# EAGLE design arduinoRGBkaleidoscopeCkt1_v4 (EAGLE 9.2.2)
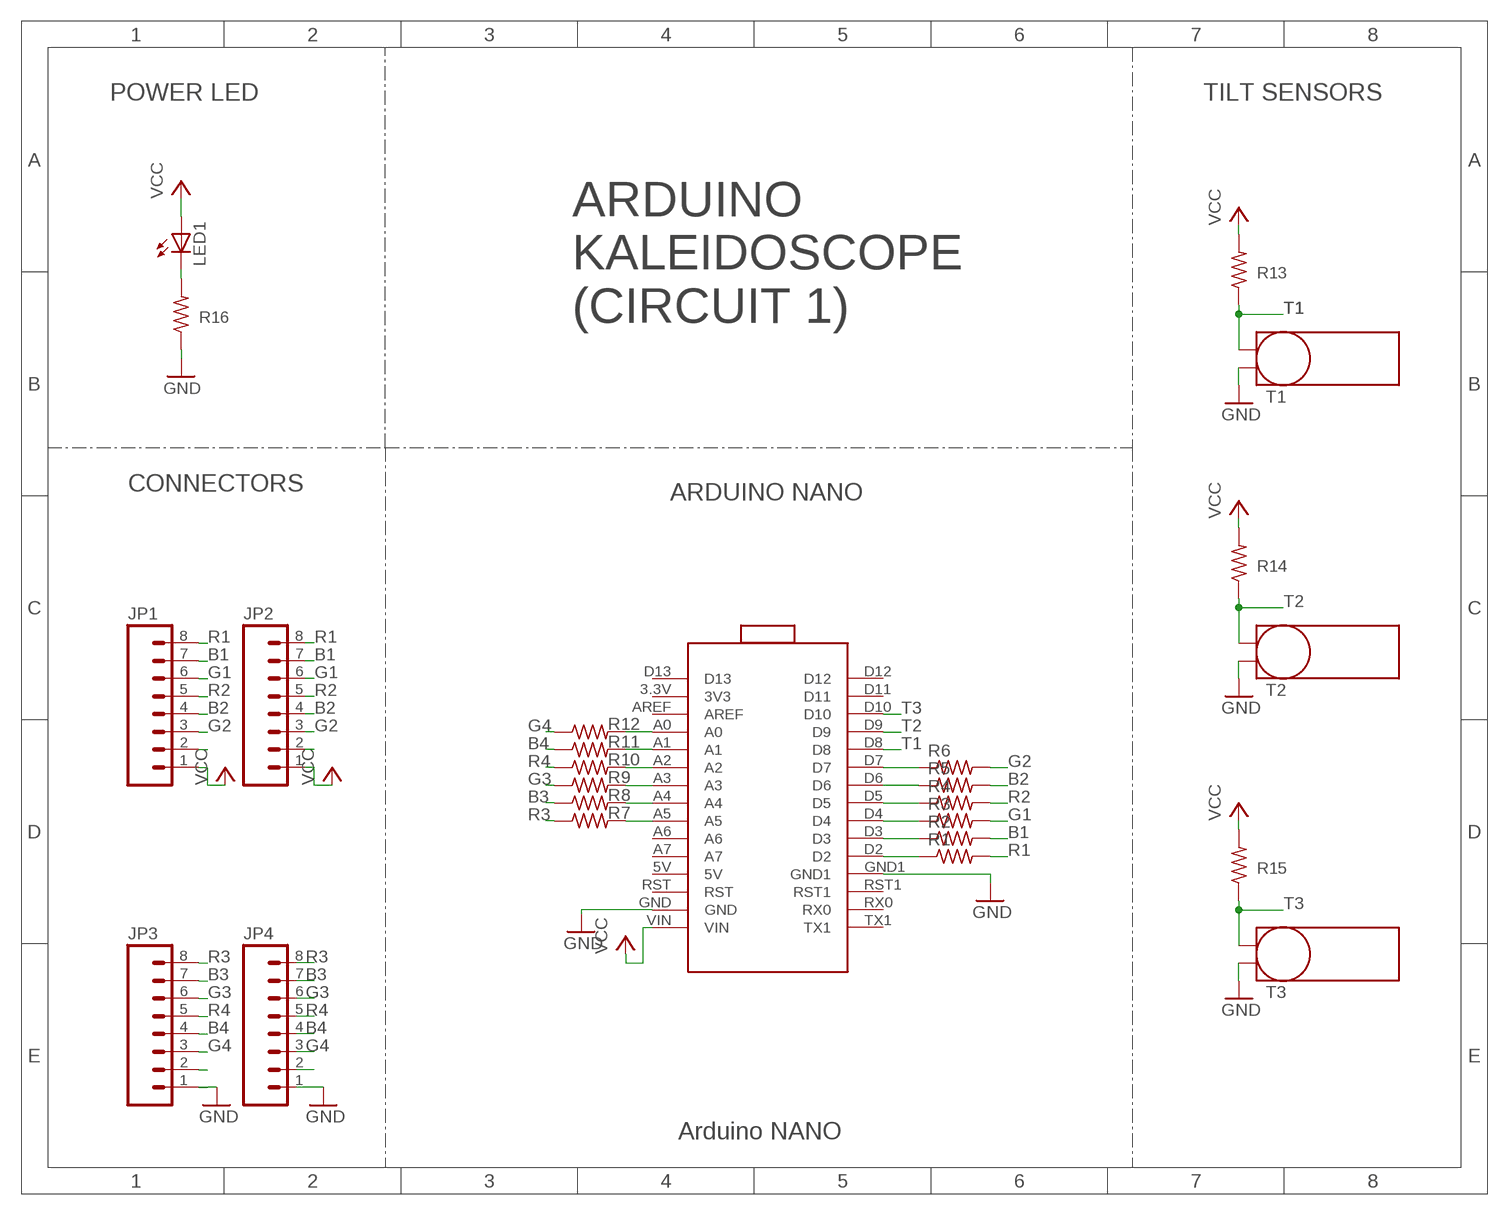
[diagram p0: schematic, sheet 1]

## Parts
JP1  M081X08  [1X08]
JP2  M081X08  [1X08]
JP3  M081X08  [1X08]
JP4  M081X08  [1X08]
LED1  LED3MM  [LED3MM]
R1  RESISTOR0805  [R0805]
R2  RESISTOR0805  [R0805]
R3  RESISTOR0805  [R0805]
R4  RESISTOR0805  [R0805]
R5  RESISTOR0805  [R0805]
R6  RESISTOR0805  [R0805]
R7  RESISTOR0805  [R0805]
R8  RESISTOR0805  [R0805]
R9  RESISTOR0805  [R0805]
R10  RESISTOR0805  [R0805]
R11  RESISTOR0805  [R0805]
R12  RESISTOR0805  [R0805]
R13  R-US_0204/7  [0204/7]
R14  R-US_0204/7  [0204/7]
R15  R-US_0204/7  [0204/7]
R16  R-US_0204/7  [0204/7]
T1  TILTSENSORE2.5-7  [TILTSENSOR]
T2  TILTSENSORE2.5-7  [TILTSENSOR]
T3  TILTSENSORE2.5-7  [TILTSENSOR]
U$2  NANO  [NANO-2]

## Nets
B1: JP1.7 JP2.7 R2.2
B2: JP1.4 JP2.4 R5.2
B3: JP3.7 JP4.7 R8.1
B4: JP3.4 JP4.4 R11.1
G1: JP1.6 JP2.6 R3.2
G2: JP1.3 JP2.3 R6.2
G3: JP3.6 JP4.6 R9.1
G4: JP3.3 JP4.3 R12.1
GND: JP3.1 JP4.1 R16.1 T1.- T2.- T3.- U$2.GND U$2.GND1
N$1: R12.2 U$2.A0
N$2: R11.2 U$2.A1
N$3: R10.2 U$2.A2
N$4: R9.2 U$2.A3
N$5: R8.2 U$2.A4
N$6: R7.2 U$2.A5
N$7: R6.1 U$2.D7
N$8: R5.1 U$2.D6
N$9: R4.1 U$2.D5
N$10: R3.1 U$2.D4
N$11: R2.1 U$2.D3
N$12: R1.1 U$2.D2
N$14: LED1.K(C) R16.2
N$15: JP2.2
N$28: JP1.2
N$36: JP4.2
N$44: JP3.2
R1: JP1.8 JP2.8 R1.2
R2: JP1.5 JP2.5 R4.2
R3: JP3.8 JP4.8 R7.1
R4: JP3.5 JP4.5 R10.1
T1: R13.1 T1.+ U$2.D8
T2: R14.1 T2.+ U$2.D9
T3: R15.1 T3.+ U$2.D10
VCC: JP1.1 JP2.1 LED1.A R13.2 R14.2 R15.2 U$2.VIN
Unconnected: U$2.3.3V(3V3) U$2.5V U$2.A6 U$2.A7 U$2.AREF U$2.D11 U$2.D12 U$2.D13 U$2.RST U$2.RST1 U$2.RX0 U$2.TX1

## Notes on the sheet
- POWER LED | TILT SENSORS
- ARDUINO
  KALEIDOSCOPE
  (CIRCUIT 1)
- CONNECTORS
- ARDUINO NANO
- Arduino NANO

## Library data of the parts
JP1-JP4 = SparkFun-Connectors:M08: Header 8 Standard 8-pin 0.1" header. Use with straight break away headers (SKU : PRT-00116), right angle break away headers (PRT-00553), swiss pins (PRT-00743), machine pins (PRT-00117), and female headers (PRT-00115).
LED1 = CEDT_JANUARY_2015_v6 (2):LED
R1-R12 = CEDT_JANUARY_2015:RESISTOR
R13-R16 = rcl:R-US_: RESISTOR, American symbol; SPICEPREFIX: R
T1-T3 = tilt-sensor:TILTSENSOR: TILT SENSOR, American symbol
U$2 = Arduino-clone:NANO: Arduino Nano

## Net classes
1 VCC: width 0.61 mm
2 GND: width 0.61 mm

## Board
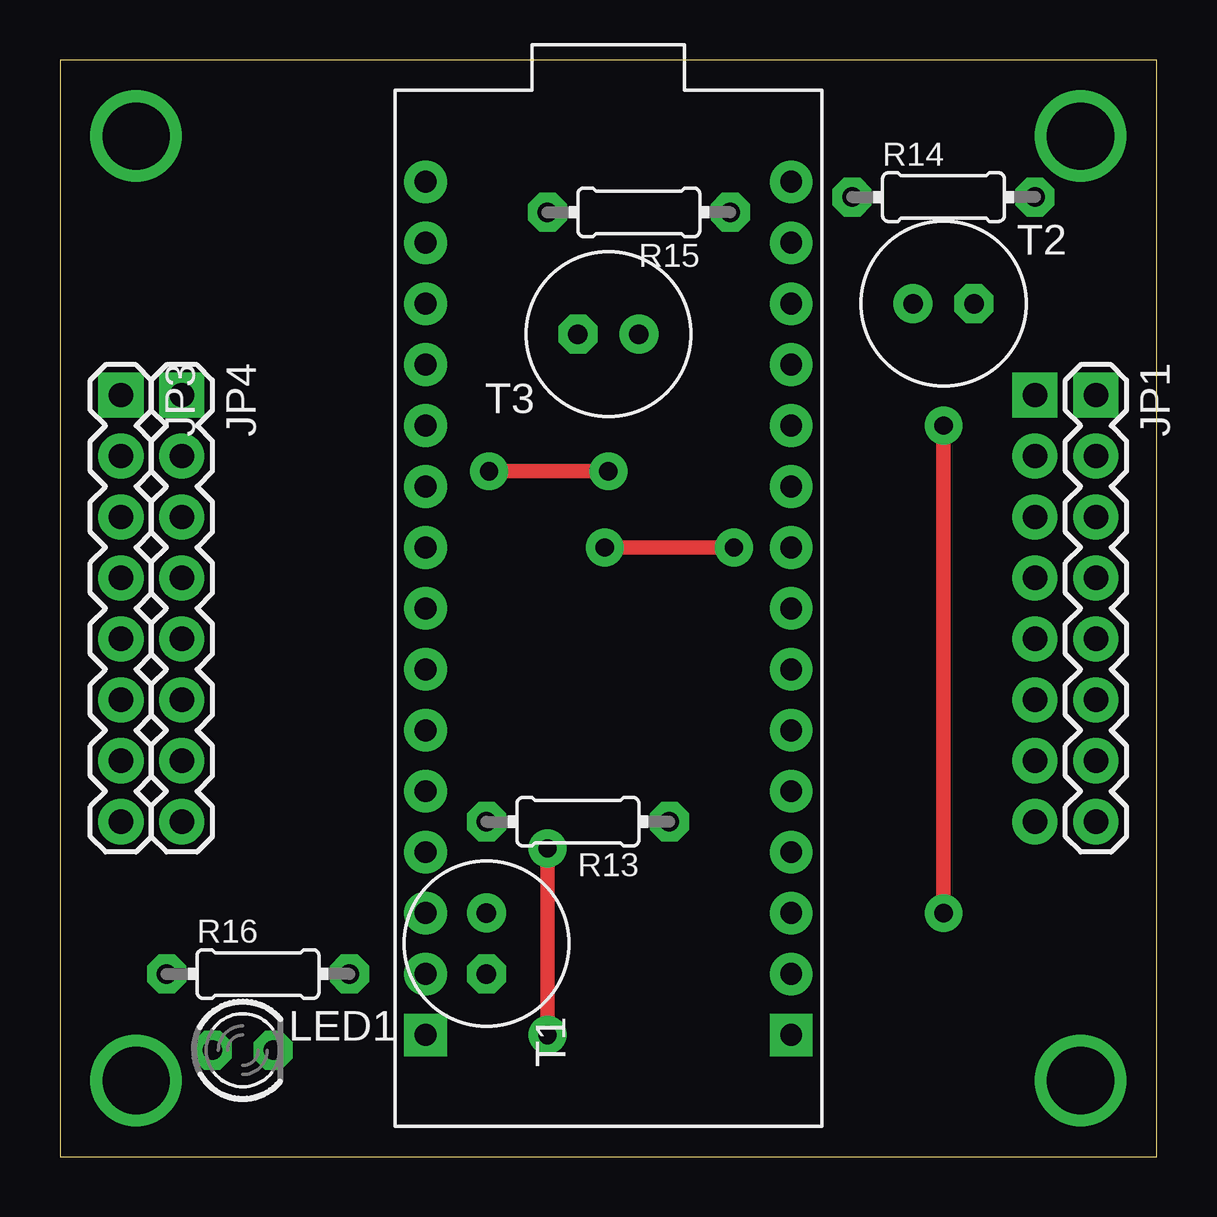
[diagram p1: board, top side]
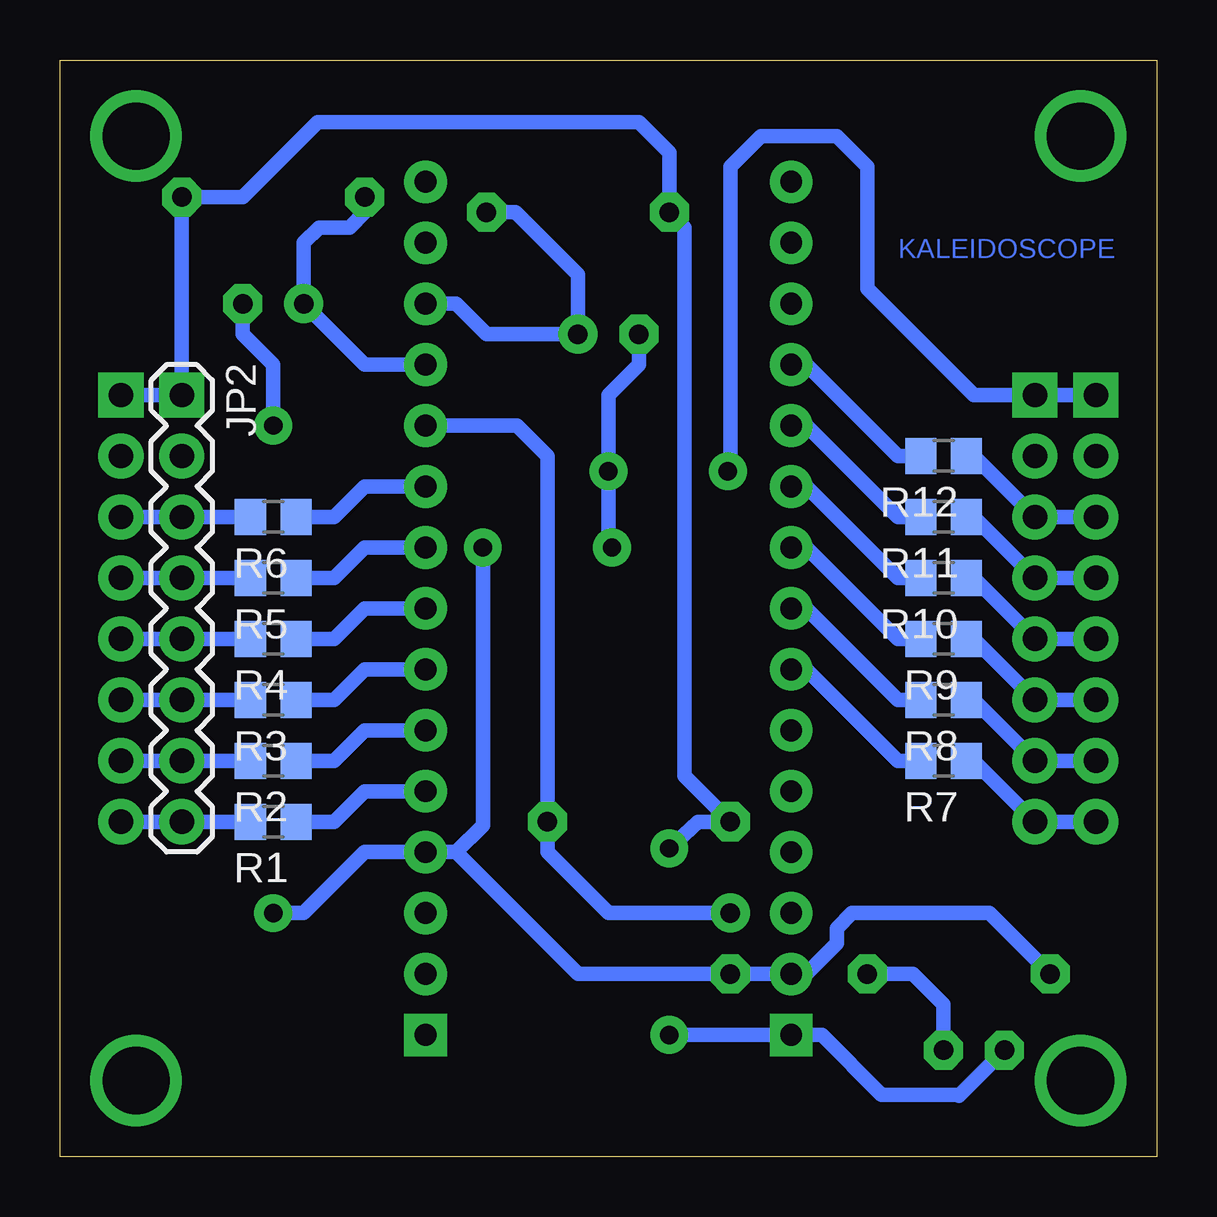
[diagram p2: board, bottom side, seen from below]

Size 45.72 x 45.72 mm. Coordinates in mm from the lower left corner, seen from the top.
Outline: 45.72,45.72 0,45.72 0,0 45.72,0 45.72,45.72
Copper layers (1*16): Top 0.035mm / dielectric 1.5mm / Bottom 0.035mm
Design rules "default *": minimum track width 10mil, minimum drill 24mil, track to track 16mil, track to pad 16mil, pad to pad 16mil, via to via 16mil, smd to smd 16mil, copper to edge 40mil, drill to drill 8mil, minimum pad ring 16mil, minimum via ring 16mil, stop-mask expansion 4mil, vias tented up to drill 0mil, thermal gap 10mil

### Footprints (pad centres in the part's own frame; a part is rotated, then mirrored left to right if it is on the bottom)
1X08 = drill 1.016 pad 1.88 square: 1 0,0 | drill 1.016 pad 1.88: 2 2.54,0; 3 5.08,0; 4 7.62,0; 5 10.16,0; 6 12.7,0; 7 15.24,0; 8 17.78,0
LED3MM = drill 0.813 octagon: A -1.27,0; K 1.27,0
R0805 = smd 1.3 x 1.5: 1 -0.95,0; 2 0.95,0
0204/7 = drill 0.813 octagon: 1 -3.81,0; 2 3.81,0
TILTSENSOR = drill 0.813 pad 1.6: + -1.27,0 | drill 0.813 pad 1.6 octagon: - 1.27,0
NANO-2 = drill 0.914 pad 1.778: 3.3V -7.62,13.97; 5V -7.62,-11.43; A0 -7.62,8.89; A1 -7.62,6.35; A2 -7.62,3.81; A3 -7.62,1.27; A4 -7.62,-1.27; A5 -7.62,-3.81; A6 -7.62,-6.35; A7 -7.62,-8.89; AREF -7.62,11.43; D2 7.62,-8.89; D3 7.62,-6.35; D4 7.62,-3.81; D5 7.62,-1.27; D6 7.62,1.27; D7 7.62,3.81; D8 7.62,6.35; D9 7.62,8.89; D10 7.62,11.43; D11 7.62,13.97; D12 7.62,16.51; D13 -7.62,16.51; GND -7.62,-16.51; GND1 7.62,-11.43; RST -7.62,-13.97; RST1 7.62,-13.97; RX0 7.62,-16.51 | drill 0.914 pad 1.778 square: TX1 7.62,-19.05; VIN -7.62,-19.05

### Placement (x,y rotation side)
JP1  43.18,31.75 270 top
JP2  40.64,31.75 270 bottom
JP3  2.54,31.75 270 top
JP4  5.08,31.75 270 top
LED1  7.62,4.45 0 top
R1  36.83,13.97 180 bottom
R2  36.83,16.51 180 bottom
R3  36.83,19.05 180 bottom
R4  36.83,21.59 180 bottom
R5  36.83,24.13 180 bottom
R6  36.83,26.67 180 bottom
R7  8.89,16.51 180 bottom
R8  8.89,19.05 180 bottom
R9  8.89,21.59 180 bottom
R10  8.89,24.13 180 bottom
R11  8.89,26.67 180 bottom
R12  8.89,29.21 180 bottom
R13  21.59,13.97 180 top
R14  36.83,40.01 0 top
R15  24.13,39.37 180 top
R16  8.26,7.62 0 top
T1  17.78,8.89 270 top
T2  36.83,35.56 0 top
T3  22.86,34.29 180 top
U$2  22.86,24.13 0 top

### Tracks (layer width: path | path; a pad name or v marks a point on that pad's centre or on a via)
B1
  Bottom 0.61: R2.2 JP2.7 JP1.7
B2
  Bottom 0.61: R5.2 JP2.4 JP1.4
B3
  Bottom 0.61: R8.1 7.62,19.05 JP4.7 JP3.7
B4
  Bottom 0.61: R11.1 7.62,26.67 JP4.4 JP3.4
G1
  Bottom 0.61: R3.2 JP2.6 JP1.6
G2
  Bottom 0.61: R6.2 JP2.3 JP1.3
G3
  Bottom 0.61: R9.1 7.62,21.59 JP4.6 JP3.6
G4
  Bottom 0.61: R12.1 7.62,29.21 JP4.3 JP3.3
GND  (via drill 0.76)
  Top 0.61: v28.09,25.4 v22.71,25.4 | v36.83,30.48 v36.83,10.16 | v17.88,28.57 v22.86,28.57
  Bottom 0.61: R16.1 6.99,10.16 12.7,10.16 13.34,9.53 13.34,8.89 14.61,7.62 U$2.GND T1.- 24.13,7.62 29.21,12.7 | 29.21,12.7 28.09,13.82 v28.09,25.4 | T3.- 21.59,33.02 22.86,31.75 v22.86,28.57 22.86,25.55 v22.71,25.4 | T2.- 38.1,34.29 36.83,33.02 v36.83,30.48 | v36.83,10.16 35.56,10.16 33.02,12.7 U$2.GND1 29.21,12.7 | v17.88,28.57 17.78,28.57 17.78,41.27 16.51,42.55 13.34,42.55 12.06,41.27 12.06,36.2 7.62,31.75 JP4.1 JP3.1
N$1
  Bottom 0.61: R12.2 10.79,29.21 14.61,33.02 U$2.A0
N$2
  Bottom 0.61: R11.2 10.79,26.67 14.61,30.48 U$2.A1
N$3
  Bottom 0.61: R10.2 10.79,24.13 14.61,27.94 U$2.A2
N$4
  Bottom 0.61: R9.2 10.79,21.59 14.61,25.4 U$2.A3
N$5
  Bottom 0.61: R8.2 10.79,19.05 14.61,22.86 U$2.A4
N$6
  Bottom 0.61: R7.2 10.79,16.51 14.61,20.32 U$2.A5
N$7
  Bottom 0.61: R6.1 34.29,26.67 33.02,27.94 U$2.D7
N$8
  Bottom 0.61: R5.1 34.29,24.13 33.02,25.4 U$2.D6
N$9
  Bottom 0.61: R4.1 34.29,21.59 33.02,22.86 U$2.D5
N$10
  Bottom 0.61: R3.1 34.29,19.05 33.02,20.32 U$2.D4
N$11
  Bottom 0.61: R2.1 34.29,16.51 33.02,17.78 U$2.D3
N$12
  Bottom 0.61: R1.1 34.29,13.97 33.02,15.24 U$2.D2
N$13  (via drill 2.8 pad 3.81)
  other vias: 3.17,42.55
N$14
  Bottom 0.61: LED1.K 8.89,6.35 10.16,7.62 R16.2
N$16  (via drill 2.8 pad 3.81)
  other vias: 42.55,42.55
N$17  (via drill 2.8 pad 3.81)
  other vias: 42.55,3.17
N$18  (via drill 2.8 pad 3.81)
  other vias: 3.17,3.17
R1
  Bottom 0.61: R1.2 JP2.8 JP1.8
R2
  Bottom 0.61: R4.2 JP2.5 JP1.5
R3
  Bottom 0.61: R7.1 7.62,16.51 JP4.8 JP3.8
R4
  Bottom 0.61: R10.1 7.62,24.13 JP4.5 JP3.5
T1
  Bottom 0.61: U$2.D8 26.67,30.48 25.4,29.21 R13.1 25.4,12.7 22.86,10.16 T1.+
T2
  Bottom 0.61: U$2.D9 33.02,33.02 T2.+ 35.56,38.1 34.92,38.73 33.66,38.73 33.02,39.37 R14.1
T3
  Bottom 0.61: R15.1 26.72,39.37 24.13,36.78 T3.+ 27.94,34.29 29.21,35.56 U$2.D10
VCC  (via drill 0.76)
  Top 0.61: v20.32,5.08 v20.32,12.85
  Bottom 0.61: LED1.A 8.26,2.54 8.26,2.59 11.48,2.59 13.97,5.08 U$2.VIN v20.32,5.08 | JP1.1 JP2.1 R14.2 38.1,40.01 34.98,43.13 21.59,43.13 20.32,41.86 R15.2 19.68,38.73 19.68,15.88 R13.2 19.13,13.97 v20.32,12.85

### Text on the board
Bottom: KALEIDOSCOPE